# Altium schematic sheet 04_AudioCodec.SchDoc
size A4; DocumentNumber: 4; SheetNumber: 4; SheetTotal: 4; sheet_title: Audio Codec
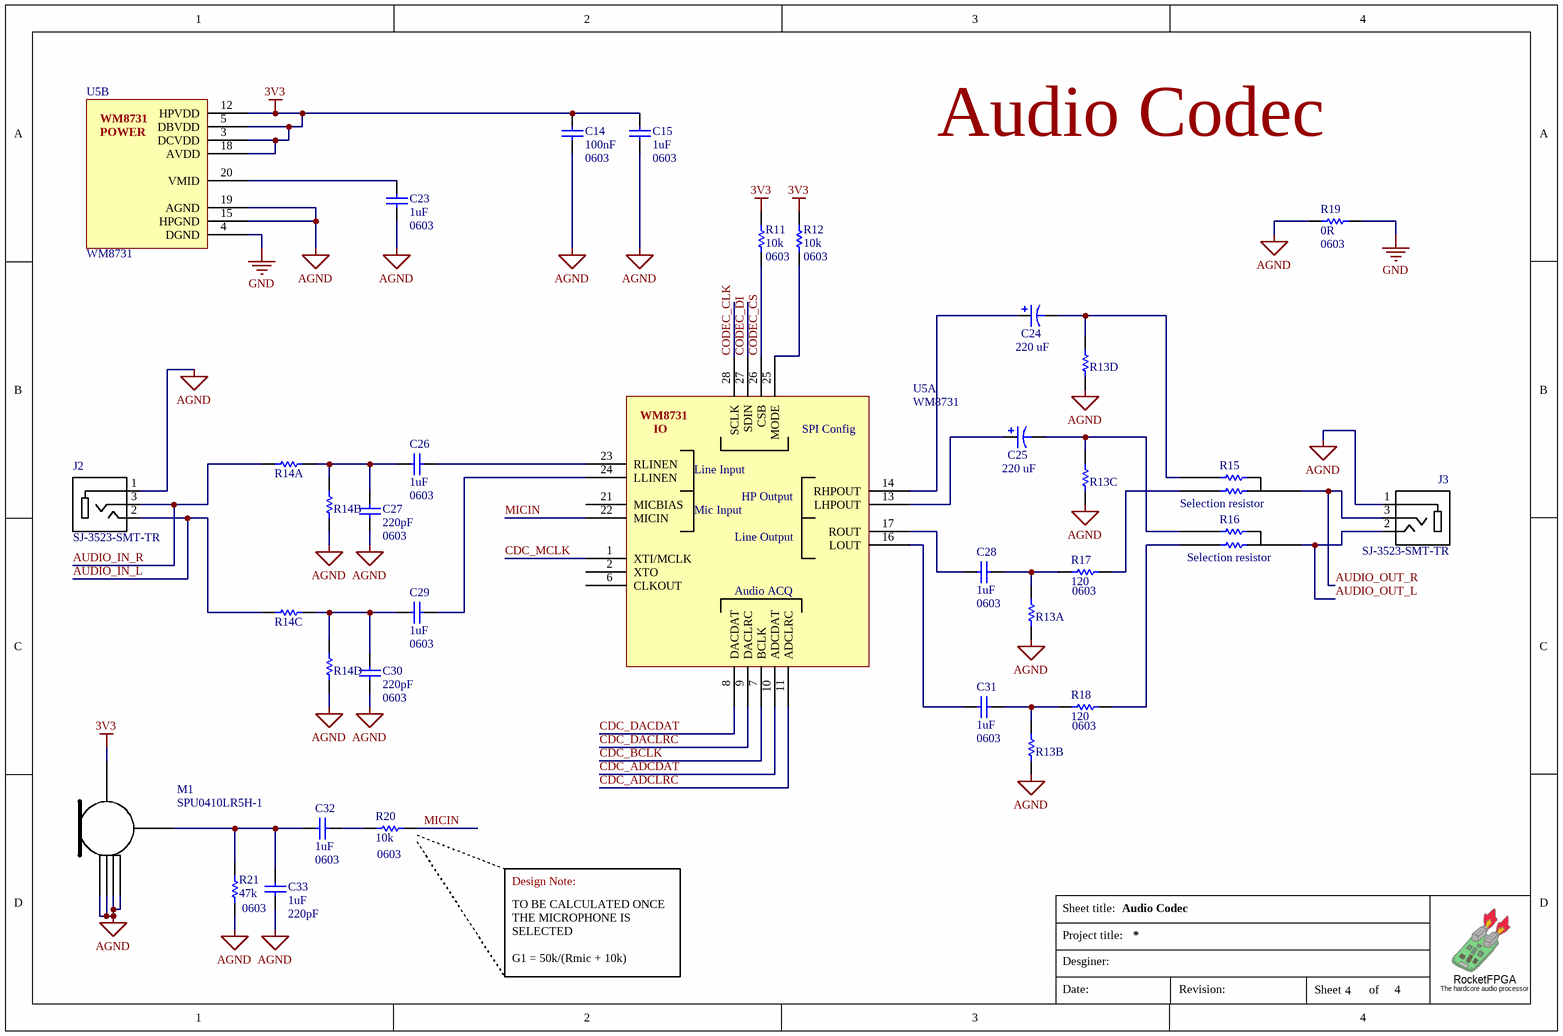
[diagram p0: 04_AudioCodec.SchDoc]

## Parts
C14  value 100nF  Package: 0603  [0603 CAP]  (hidden comment: Ceramic capacitor)
C15  value 1uF  Package: 0603  [0603 CAP]  (hidden comment: Ceramic capacitor)
C23  value 1uF  Package: 0603  [0603 CAP]  (hidden comment: Ceramic capacitor)
C24  value 220 uF  [CAPCP3216X16N]  (hidden comment: Capacitor Electrolitic)
C25  value 220 uF  [CAPCP3216X16N]  (hidden comment: Capacitor Electrolitic)
C26  value 1uF  Package: 0603  [0603 CAP]  (hidden comment: Ceramic capacitor)
C27  value 220pF  Package: 0603  [0603 CAP]  (hidden comment: Ceramic capacitor)
C28  value 1uF  Package: 0603  [0603 CAP]  (hidden comment: Ceramic capacitor)
C29  value 1uF  Package: 0603  [0603 CAP]  (hidden comment: Ceramic capacitor)
C30  value 220pF  Package: 0603  [0603 CAP]  (hidden comment: Ceramic capacitor)
C31  value 1uF  Package: 0603  [0603 CAP]  (hidden comment: Ceramic capacitor)
C32  value 1uF  Package: 0603  [0603 CAP]  (hidden comment: Ceramic capacitor)
C33  value 1uF  Package: 220pF  [0603 CAP]  (hidden comment: Ceramic capacitor)
J2  SJ-3523-SMT-TR  [CUI_SJ-3523-SMT-TR]
J3  SJ-3523-SMT-TR  [CUI_SJ-3523-SMT-TR]
M1  SPU0410LR5H-1  [SPU0410LR5H-1]
R11  value 10k  Package: 0603  [Resistencia 0603]  (hidden comment: Resistor)
R12  value 10k  Package: 0603  [Resistencia 0603]  (hidden comment: Resistor)
R13  Resistor array  (value not drawn)  (parts A,B,C,D of 4)
R14  Resistor array  (value not drawn)  (parts A,B,C,D of 4)
R15  Selection resistor
R16  Selection resistor
R17  value 120  Package: 0603  [Resistencia 0603]  (hidden comment: Resistor)
R18  value 120  Package: 0603  [Resistencia 0603]  (hidden comment: Resistor)
R19  value 0R  Package: 0603  [Resistencia 0603]  (hidden comment: Resistor)
R20  value 10k  Package: 0603  [Resistencia 0603]  (hidden comment: Resistor)
R21  value 47k  Package: 0603  [Resistencia 0603]  (hidden comment: Resistor)
U5  WM8731  [WM8731]  (parts A,B of 2)

## Nets
3V3: C14.1 C15.1 M1.4 R11.2 R12.2 U5.3(DCVDD) U5.5(DBVDD) U5.12(HPVDD) U5.18(AVDD)
AGND: C14.2 C15.2 C23.2 C27.2 C30.2 C33.2 J2.1 J3.1 M1.2 M1.3 M1.5 M1.6 R13.5 R13.6 R13.7 R13.8 R14.2 R14.4 R19.2 R21.1 U5.15(HPGND) U5.19(AGND)
GND: R19.1 U5.4(DGND)
AUDIO_IN_L: J2.2 R14.3
AUDIO_IN_R: J2.3 R14.1
AUDIO_OUT_L: J3.2 R16.2
AUDIO_OUT_R: J3.3 R15.2
CDC_ADCDAT: U5.10(ADCDAT)
CDC_ADCLRC: U5.11(ADCLRC)
CDC_BCLK: U5.7(BCLK)
CDC_DACDAT: U5.8(DACDAT)
CDC_DACLRC: U5.9(DACLRC)
CDC_MCLK: U5.1(XTI/MCLK)
CODEC_CLK: U5.28(SCLK)
CODEC_CS: R11.1 U5.26(CSB)
CODEC_DI: U5.27(SDIN)
MICIN: R20.2 U5.22(MICIN)
NetC23_1: C23.1 U5.20(VMID)
NetC24_1: C24.1 U5.14(RHPOUT)
NetC24_2: C24.2 R13.4 R15.1
NetC25_1: C25.1 U5.13(LHPOUT)
NetC25_2: C25.2 R13.3 R16.1
NetC26_1: C26.1 C27.1 R14.7 R14.8
NetC26_2: C26.2 U5.23(RLINEN)
NetC28_1: C28.1 U5.17(ROUT)
NetC28_2: C28.2 R13.1 R17.1
NetC29_1: C29.1 U5.24(LLINEN)
NetC29_2: C29.2 C30.1 R14.5 R14.6
NetC31_1: C31.1 U5.16(LOUT)
NetC31_2: C31.2 R13.2 R18.1
NetC32_1: C32.1 R20.1
NetC32_2: C32.2 C33.1 M1.1 R21.2
NetR12_1: R12.1 U5.25(MODE)
NetR15_3: R15.3 R17.2
NetR16_3: R16.3 R18.2

Not connected (* = marked no-connect by the designer): U5 2(XTO) 6(CLKOUT) 21(MICBIAS)

## Notes on the sheet
- Audio Codec
- Design Note:
- TO BE CALCULATED ONCE THE MICROPHONE IS SELECTED
  G1 = 50k/(Rmic + 10k)
- Sheet title:
- Project title:
- Desginer:
- The hardcore audio processor
- RocketFPGA
- Date:
- Revision:
- Sheet
- of
- (in symbol WM8731, part A) IO; SPI Config; Line Input; HP Output; Mic Input; Line Output; Audio ACQ
- (in symbol WM8731, part B) POWER

## Library data of the parts
C14 = Capacitor: vendor: LCSC; vendorID: 0603F104M500NT; Supplier 1: Mouser; Supplier Part Number 1: 80-C1206C104K5R; ManufacturerReference: -; price: 0.0023
C15 C23 C26 C28 C29 C31-C33 = Capacitor: vendor: LCSC; vendorID: CC0603ZRY5V7BB105; Supplier 1: Mouser; Supplier Part Number 1: 80-C1206C104K5R; ManufacturerReference: -; price: 0.0053
C24 C25 = Capacitor Electrolitic: Vendor: LCSC; Author: Jaime Jiménez Ortega; Date: 21/05/2009; Link: https://lcsc.com/product-detail/Others_TANCAP-Tech-CA45-227M004BT_C327726.html
C27 C30 = Capacitor: vendor: LCSC; vendorID: 0603B221K500NT; Supplier 1: Mouser; Supplier Part Number 1: 80-C1206C104K5R; ManufacturerReference: -; price: 0.0035
J2 = SJ-3523-SMT-TR: Jack connector; vendor: Mouser; Vendor 2: LCSC; Link 2: https://lcsc.com/product-detail/Audio-Video-Connectors_BOOMELE-Boom-Precision-Elec-PJ-320B_C18594.html; Link: https://www.mouser.es/ProductDetail/CUI-Devices/SJ-3523-SMT-TR?qs=WyjlAZoYn51zOHzJ3r4ZRA%3D%3D
J3 = SJ-3523-SMT-TR: vendor: Mouser; vendorID: 490-SJ-3523-SMT-TR; ManufacturerReference: SJ-3523-SMT-TR; Package: -; price: 0.777
M1 = SPU0410LR5H-1: MEMS Microphone; Vendor: Mouser; Link: https://www.mouser.es/ProductDetail/Knowles/SPU0410LR5H-QB?qs=%2Fha2pyFadujsOyq9m86PskfJJTo%2F6w8gLVlLZDQM1tgnAEafFx2amg%3D%3D
R11 R12 R20 = Resistor: vendor: LCSC; vendorID: 0603WAF1002T5E; Supplier 1: Farnell; Supplier Part Number 1: 2358436; ManufacturerReference: -; price: 0.0009
R13 R14 = ResistorArray_4: 4 resistors in smd array configuration; Vendor: LCSC; Link: https://lcsc.com/product-detail/Resistor-Networks-Arrays_BOURNS_CAT10-562J4LF_BOURNS-CAT10-562J4LF_C148532.html; Link 2: https://lcsc.com/product-detail/Resistor-Networks-Arrays_BOURNS_CAT10-473J4LF_47KR-473-5_C148526.html
R15 R16 = SelectionResistor
R17 R18 = Resistor: vendor: LCSC; vendorID: CR0603FA1200G; Supplier 1: Farnell; Supplier Part Number 1: 2358436; ManufacturerReference: -; price: 0.0024
R19 R21 = Resistor: vendor: LCSC; vendorID: RS-03K473JT; Supplier 1: Farnell; Supplier Part Number 1: 2358436; ManufacturerReference: -; price: 0.0007
U5 = WM8731: Portable Internet Audio CODEC with Headphone Driver  and Programmable Sample Rates; Vendor: Mouser; Link: https://www.mouser.es/ProductDetail/Cirrus-Logic/WM8731CSEFL?qs=3kEcuH7qFhd2WZOaNm6tsA%3D%3D